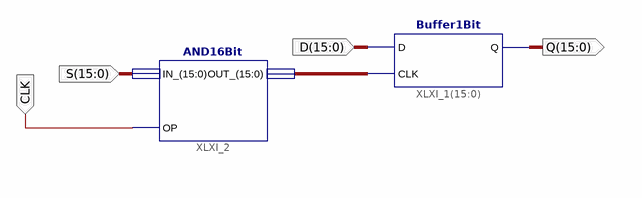
[diagram p0: schematic sheet 1]
// Xilinx ISE schematic Buffer16Bit.sch (spartan6) as structural Verilog: 2 symbols, 4 ports
module Buffer16Bit (
  input  [15:0] D,
  input  CLK,
  input  [15:0] S,
  output [15:0] Q
);

  wire [15:0] XLXN_1;

  Buffer1Bit XLXI_1[15:0] (.D(D), .CLK(XLXN_1), .Q(Q));
  AND16Bit XLXI_2 (.IN_(S), .OP(CLK), .OUT_(XLXN_1));
endmodule
